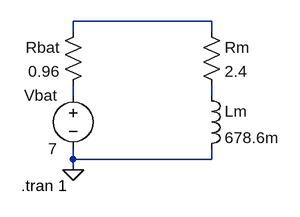
[diagram p0: schematic bat-mtr.asc]
bat-mtr.asc, the LTspice schematic file:
Version 4
SHEET 1 880 680
WIRE 320 32 112 32
WIRE 112 48 112 32
WIRE 320 48 320 32
WIRE 112 144 112 128
WIRE 320 144 320 128
WIRE 112 240 112 224
WIRE 320 240 320 224
WIRE 320 240 112 240
WIRE 112 256 112 240
FLAG 112 256 0
SYMBOL voltage 112 128 M0
SYMATTR InstName Vbat
SYMATTR Value 7
SYMBOL res 128 32 M0
SYMATTR InstName Rbat
SYMATTR Value 0.96
SYMBOL res 304 32 R0
SYMATTR InstName Rm
SYMATTR Value 2.4
SYMBOL ind 304 128 R0
SYMATTR InstName Lm
SYMATTR Value 678.6m
TEXT 34 280 Left 2 !.tran 1

The netlist it stands for:
* bat-mtr.asc
Vbat N002 0 7
Rbat N001 N002 0.96
Rm N001 N003 2.4
Lm N003 0 678.6m
.tran 1
.backanno
.end